# EAGLE schematic Card_Edge_Board (EAGLE 7.2.0)
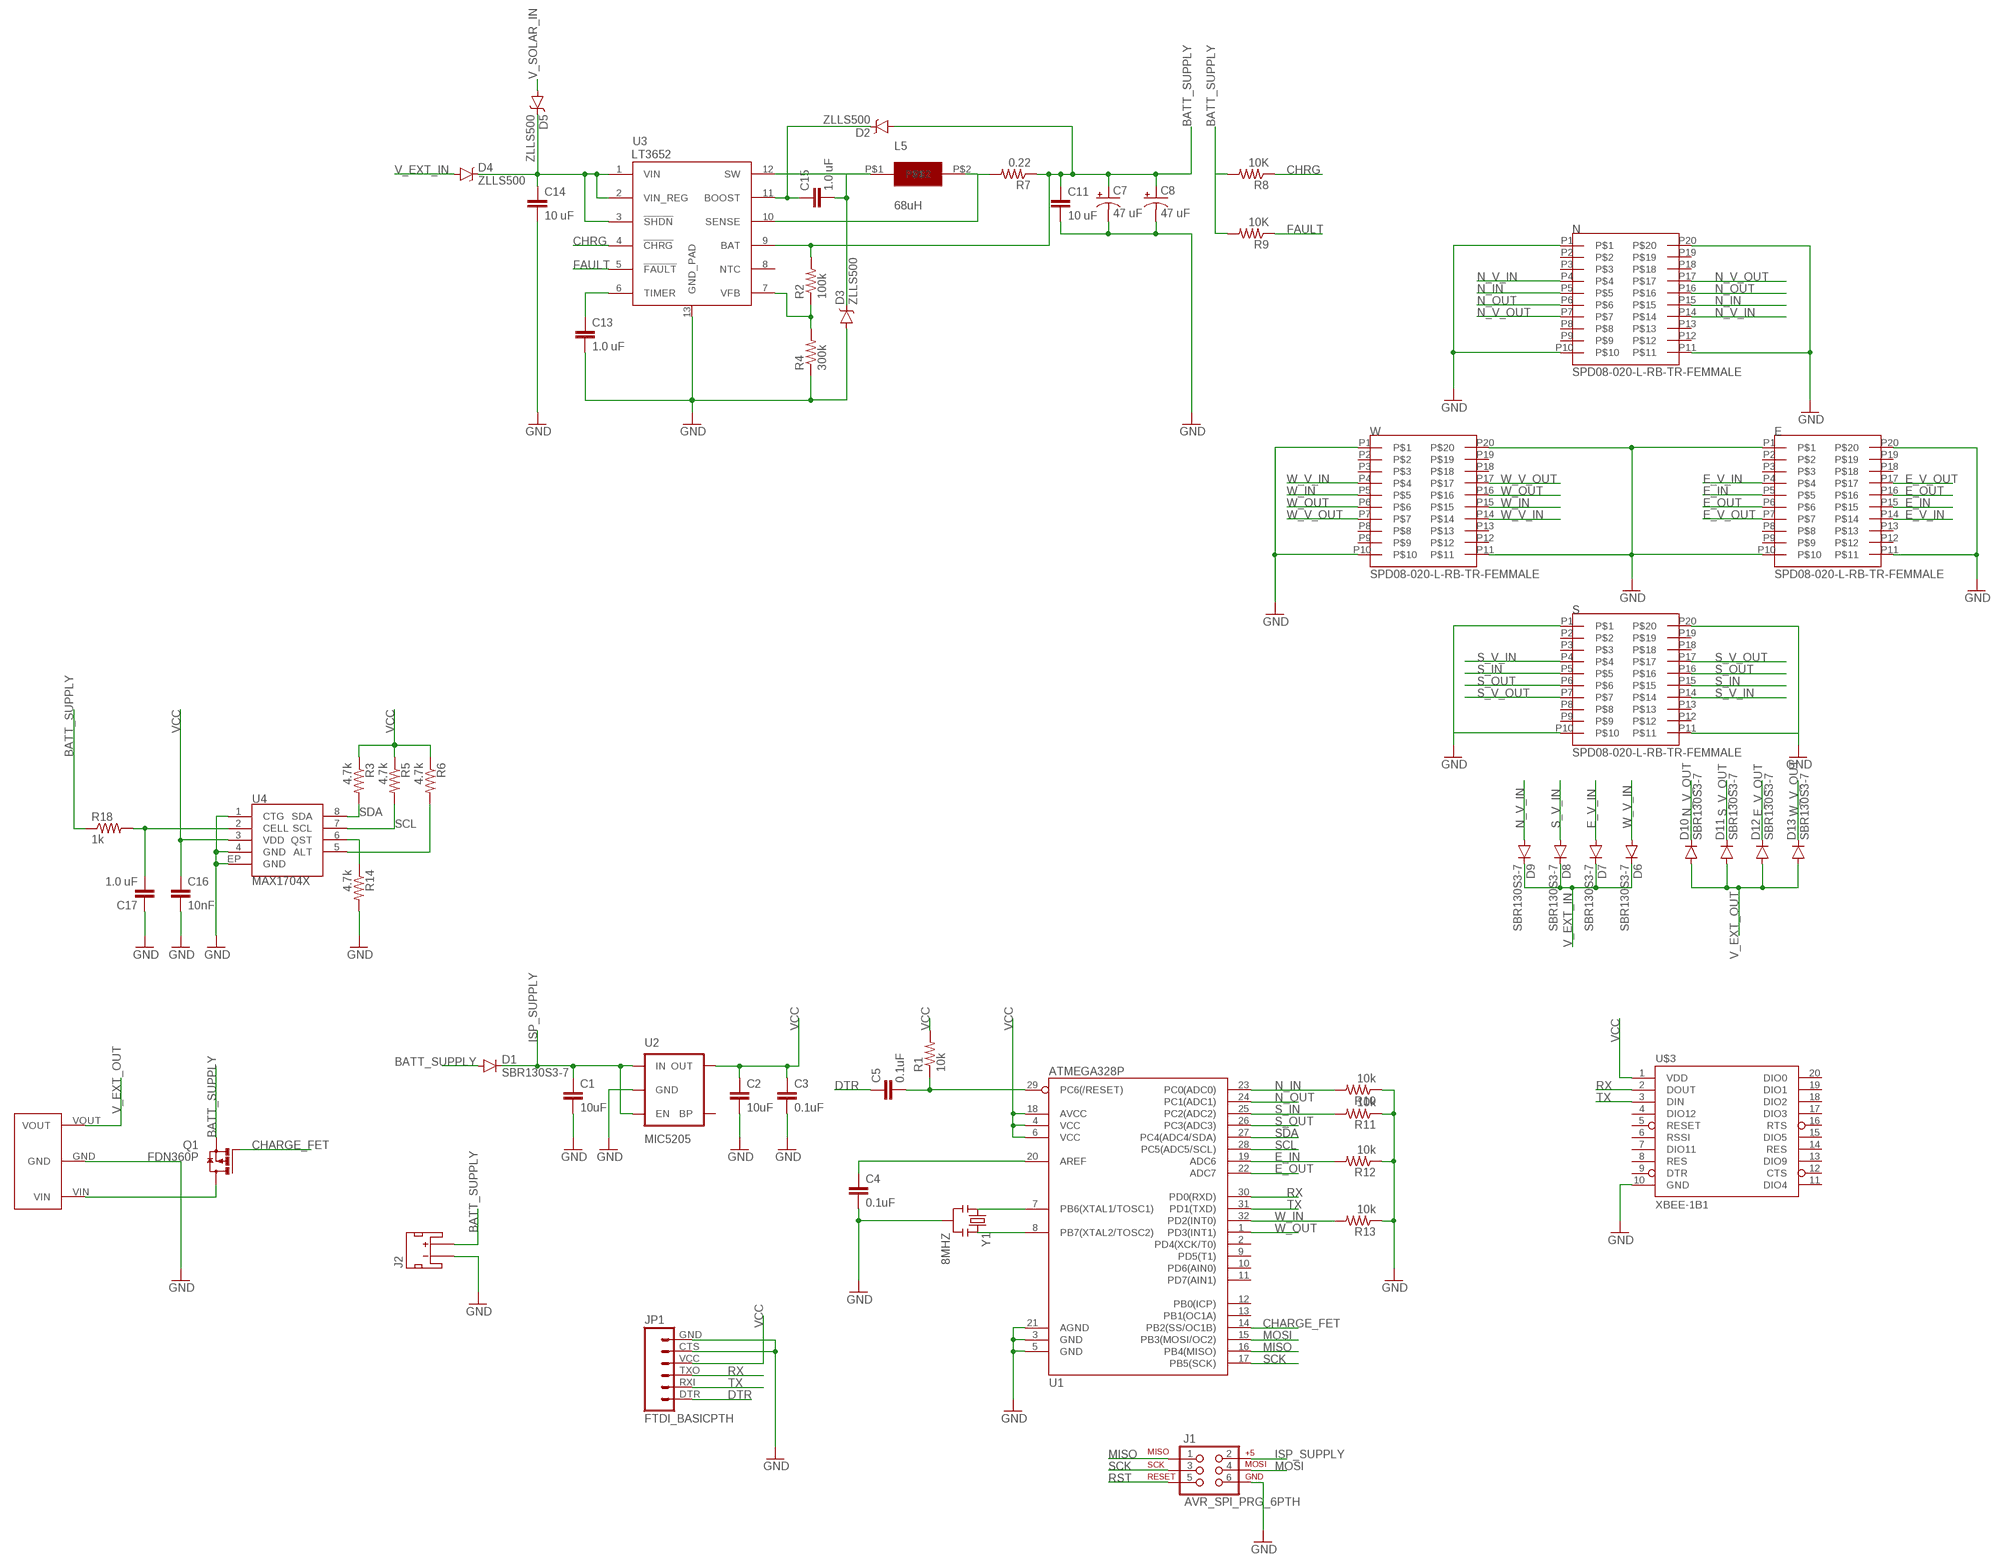
[diagram p0: schematic, sheet 1]

## Parts
C1  10uF  CAP1206  [1206]
C2  10uF  CAP1206  [1206]
C3  0.1uF  CAP1206  [1206]
C4  0.1uF  CAP1206  [1206]
C5  0.1uF  CAP1206  [1206]
C7  47 uF  CAP_POL1206  [EIA3216]
C8  47 uF  CAP_POL1206  [EIA3216]
C11  10 uF  10UF-6.3V-20%(1206)  [1206]
C13  1.0 uF  10UF-6.3V-20%(1206)  [1206]
C14  10 uF  10UF-6.3V-20%(1206)  [1206]
C15  1.0 uF  10UF-6.3V-20%(1206)  [1206]
C16  10nF  10UF-6.3V-20%(1206)  [1206]
C17  1.0 uF  10UF-6.3V-20%(1206)  [1206]
D1  SBR130S3-7  DIODESOD  [SOD-323]
D2  ZLLS500  ZLLS500ZLLS500  [SOT23]
D3  ZLLS500  ZLLS500ZLLS500  [SOT23]
D4  ZLLS500  ZLLS500ZLLS500  [SOT23]
D5  ZLLS500  ZLLS500ZLLS500  [SOT23]
D6  SBR130S3-7  DIODESOD  [SOD-323]
D7  SBR130S3-7  DIODESOD  [SOD-323]
D8  SBR130S3-7  DIODESOD  [SOD-323]
D9  SBR130S3-7  DIODESOD  [SOD-323]
D10  SBR130S3-7  DIODESOD  [SOD-323]
D11  SBR130S3-7  DIODESOD  [SOD-323]
D12  SBR130S3-7  DIODESOD  [SOD-323]
D13  SBR130S3-7  DIODESOD  [SOD-323]
E  SPD08-020-L-RB-TR-FEMMALE  [SPD08-020-L-RB-TR-FOOT]
J1  AVR_SPI_PRG_6PTH  [2X3]
J2  JST_2MM_MALE  [JST-2-SMD]
JP1  FTDI_BASICPTH  [FTDI_BASIC]
L5  68uH  MURATA_29L683CSMD1  [MURATA_29L68C]
N  SPD08-020-L-RB-TR-FEMMALE  [SPD08-020-L-RB-TR-FOOT]
Q1  FDN360P  [SUPER-SOT3]
R1  10k  RESISTOR1206  [1206]
R2  100k  RESISTOR1206  [1206]
R3  4.7k  RESISTOR1206  [1206]
R4  300k  RESISTOR1206  [1206]
R5  4.7k  RESISTOR1206  [1206]
R6  4.7k  RESISTOR1206  [1206]
R7  0.22  RESISTOR1206  [1206]
R8  10K  RESISTOR1206  [1206]
R9  10K  RESISTOR1206  [1206]
R10  10k  RESISTOR1206  [1206]
R11  10k  RESISTOR1206  [1206]
R12  10k  RESISTOR1206  [1206]
R13  10k  RESISTOR1206  [1206]
R14  4.7k  RESISTOR1206  [1206]
R18  1k  RESISTOR1206  [1206]
S  SPD08-020-L-RB-TR-FEMMALE  [SPD08-020-L-RB-TR-FOOT]
U1  ATMEGA328P  ATMEGA328_SMT  [TQFP32-08]
U2  MIC5205  MIC52053.3V  [SOT23-5]
U3  LT3652  [MSOP-12_GND]
U4  MAX1704X  [TDFN-8]
U$1  POLOLU791BOOSTPOLOLU  [POLOLU791_BOOST]
U$3  XBEE-1B1  [XBEE-1]
W  SPD08-020-L-RB-TR-FEMMALE  [SPD08-020-L-RB-TR-FOOT]
Y1  8MHZ  RESONATOR8MHZ  [RESONATOR-SMD]

## Nets
BATT_SUPPLY: C7.A(+) C8.A(+) C11.1 D1.A D2.1(A) J2.2(+) Q1.2(S) R2.2 R7.1 R8.2 R9.2 R18.1 U3.9(BAT)
CHARGE_FET: Q1.1(G) U1.14(PB2(SS/OC1B))
CHRG: R8.1 U3.4(!CHRG)
DTR: C5.1 JP1.DTR
E_IN: E.P5 E.P15 R12.2 U1.19(ADC6)
E_OUT: E.P6 E.P16 U1.22(ADC7)
E_V_IN: D7.A E.P4 E.P14
E_V_OUT: D12.C E.P7 E.P17
FAULT: R9.1 U3.5(!FAULT)
GND: C1.2 C2.2 C3.2 C4.2 C7.C(-) C8.C(-) C11.2 C13.2 C14.2 C16.2 C17.1 D3.1(A) E.P1 E.P10 E.P11 E.P20 J1.6 J2.1(-) JP1.CTS JP1.GND N.P1 N.P10 N.P11 N.P20 R4.1 R10.1 R11.1 R12.1 R13.1 R14.2 S.P1 S.P10 S.P11 S.P20 U1.3(GND) U1.5(GND) U1.21(AGND) U2.2(GND) U3.13(GND_PAD) U4.1(CTG) U4.4(GND) U4.EP(GND) U$1.GND U$3.10(GND) W.P1 W.P10 W.P11 W.P20 Y1.2
ISP_SUPPLY: C1.1 D1.C J1.2 U2.1(IN) U2.3(EN)
MISO: J1.1 U1.16(PB4(MISO))
MOSI: J1.4 U1.15(PB3(MOSI/OC2))
N$1: C13.1 U3.6(TIMER)
N$2: L5.P$2 R7.2 U3.10(SENSE)
N$4: C4.1 U1.20(AREF)
N$6: R6.2 U4.5(ALT)
N$8: R2.1 R4.2 U3.7(VFB)
N$10: C15.1 D2.3(C) U3.11(BOOST)
N$11: C15.2 D3.3(C) L5.P$1 U3.12(SW)
N$14: R14.1 U4.6(QST)
N$19: Q1.3(D) U$1.VIN
N$20: U1.8(PB7(XTAL2/TOSC2)) Y1.3
N$21: U1.7(PB6(XTAL1/TOSC1)) Y1.1
N$22: C17.2 R18.2 U4.2(CELL)
N$31: C14.1 D4.3(C) D5.3(C) U3.1(VIN) U3.2(VIN_REG) U3.3(!SHDN)
N_IN: N.P5 N.P15 R10.2 U1.23(PC0(ADC0))
N_OUT: N.P6 N.P16 U1.24(PC1(ADC1))
N_V_IN: D9.A N.P4 N.P14
N_V_OUT: D10.C N.P7 N.P17
RST: C5.2 J1.5 R1.1 U1.29(PC6(/RESET))
RX: JP1.TXO U1.30(PD0(RXD)) U$3.2(DOUT)
S_IN: R11.2 S.P5 S.P15 U1.25(PC2(ADC2))
S_OUT: S.P6 S.P16 U1.26(PC3(ADC3))
S_V_IN: D8.A S.P4 S.P14
S_V_OUT: D11.C S.P7 S.P17
SCK: J1.3 U1.17(PB5(SCK))
SCL: R5.2 U1.28(PC5(ADC5/SCL)) U4.7(SCL)
SDA: R3.2 U1.27(PC4(ADC4/SDA)) U4.8(SDA)
TX: JP1.RXI U1.31(PD1(TXD)) U$3.3(DIN)
V_EXT_IN: D4.1(A) D6.C D7.C D8.C D9.C
V_EXT_OUT: D10.A D11.A D12.A D13.A U$1.VOUT
V_SOLAR_IN: D5.1(A)
VCC: C2.1 C3.1 C16.1 JP1.VCC R1.2 R3.1 R5.1 R6.1 U1.4(VCC) U1.6(VCC) U1.18(AVCC) U2.5(OUT) U4.3(VDD) U$3.1(VDD)
W_IN: R13.2 U1.32(PD2(INT0)) W.P5 W.P15
W_OUT: U1.1(PD3(INT1)) W.P6 W.P16
W_V_IN: D6.A W.P4 W.P14
W_V_OUT: D13.C W.P7 W.P17
Unconnected: E.P2 E.P3 E.P8 E.P9 E.P12 E.P13 E.P18 E.P19 J2.NC1(PAD1) J2.NC2(PAD2) N.P2 N.P3 N.P8 N.P9 N.P12 N.P13 N.P18 N.P19 S.P2 S.P3 S.P8 S.P9 S.P12 S.P13 S.P18 S.P19 U1.2(PD4(XCK/T0)) U1.9(PD5(T1)) U1.10(PD6(AIN0)) U1.11(PD7(AIN1)) U1.12(PB0(ICP)) U1.13(PB1(OC1A)) U2.4(BP) U3.8(NTC) U$3.4(DIO12) U$3.5(RESET) U$3.6(RSSI) U$3.7(DIO11) U$3.8(RES) U$3.9(DTR) U$3.11(DIO4) U$3.12(CTS) U$3.13(DIO9) U$3.14(RES) U$3.15(DIO5) U$3.16(RTS) U$3.17(DIO3) U$3.18(DIO2) U$3.19(DIO1) U$3.20(DIO0) W.P2 W.P3 W.P8 W.P9 W.P12 W.P13 W.P18 W.P19

## Library data of the parts
C1-C5 = SparkFun-Capacitors:CAP: Capacitor Standard 0603 ceramic capacitor, and 0.1" leaded capacitor.
C7 C8 = SparkFun-Capacitors:CAP_POL: Capacitor Polarized These are standard SMD and PTH capacitors. Normally 10uF, 47uF, and 100uF in electrolytic and tantalum varieties. Always verify the external diameter of the through hole cap, it varies with capacity, voltage, and manufacturer. The EIA devices should be standard.
C11 C13-C17 = SparkFun-Capacitors:10UF-6.3V-20%(1206): CAP-10057 Ceramic; PROD_ID: CAP-10057; VALUE: 10uF
D1 D6-D13 = SparkFun-DiscreteSemi:DIODE: Diode These are standard reverse protection diodes and small signal diodes. SMA package can handle up to about 1A. SOD-323 can handle about 200mA. What the SOD-323 package when ordering, there are some mfgs out there that are 5-pin packages.; PROD_ID: DIO-09646
D2-D5 = SparkFun-DiscreteSemi:ZLLS500: 700mA 40V SOT-23 Schottky; PROD_ID: DIO-08411
E N S W = Local_RUBICS:SPD08-020-L-RB-TR-FEM
J1 = SparkFun-Connectors:AVR_SPI_PRG_6: AVR ISP 6 Pin This is the reduced ISP connector for AVR programming. Common on Arduino. This footprint will take up less PCB space and can be used with a 10-pin to 6-pin adapter such as SKU: BOB-08508 **Special note about "TEST_POINT" package. The stop mask is on the top side, so if you want your programming test points to be on the bottom of your board, make sure to place this package on the bottom side of the board. This also ensure that the orientation to program from the bottom side will be correct.
J2 = SparkFun-Connectors:JST_2MM_MALE: Mates to single-cell LiPo batteries. CONN-08352; PROD_ID: CONN-08352
JP1 = SparkFun-Connectors:FTDI_BASIC: FTDI Basic header with labels
L5 = Local_RUBICS:MURATA_29L683C
Q1 = transistor-power:FDN360P: Single P-Channel, PowerTrench (R) MOSFET Source: http://www.fairchildsemi.com/ds/FD/FDN360P.pdf
R1-R14 R18 = SparkFun-Resistors:RESISTOR: Resistor Basic schematic elements and footprints for 0603, 1206, and PTH resistors.
U1 = SparkFun-DigitalIC:ATMEGA328_SMT: 32-Pin Atmega328 part Commonly used on Arduino compatible boards Available in QFP and QFN packages TQFP is IC-09069 QFN is non-stock; PROD_ID: IC-09069
U2 = SparkFun-PowerIC:MIC5205: MIC5205 150mA vreg 3.3V - VREG-00822 5V - VREG-00823; PROD_ID: VREG-00822
U3 = SparkFun-PowerIC:LT3652: LT3652 MPPT Solar Charge Controller 5V-32V smart charger for batteries up to 14.4V
U4 = SparkFun-PowerIC:MAX1704X: MAX17043/MAX17044: Battery Fuel Guage (43 is 1cell, 44 is 2cell)
U$1 = Local_RUBICS:POLOLU791BOOST
U$3 = SparkFun-RF:XBEE-1: Xbee module footprints SMT header is CONN-09042.
Y1 = SparkFun-FreqCtrl:RESONATOR: Resonator Small SMD resonator. Used, eg, on the Arduino Pro/ Pro Mini boards. 8MHz- XTAL-08895 16MHz- XTAL-08900; PROD_ID: XTAL-08895